# Altium schematic sheet Sheet_1_2021-12-20.schdoc
size 49 x 28 mm
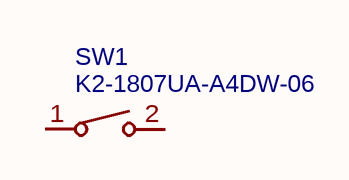
[diagram p0: Sheet_1_2021-12-20.schdoc]

## Parts
SW1  K2-1807UA-A4DW-06  [KEY-SMD_L4.0-W2.9-L]

## Nets

Not connected (* = marked no-connect by the designer): SW1 1 2

## Library data of the parts
SW1 = K2-1807UA-A4DW-06: BOM_Manufacturer: Korean Hroparts Elec; Contributor: LCSC; BOM_Supplier: LCSC; BOM_Supplier Part: C502307; BOM_Manufacturer Part: K2-1807UA-A4DW-06; BOM_JLCPCB Part Class: Extended Part; spicePre: S; spiceSymbolName: K2-1807UA-A4DW-06